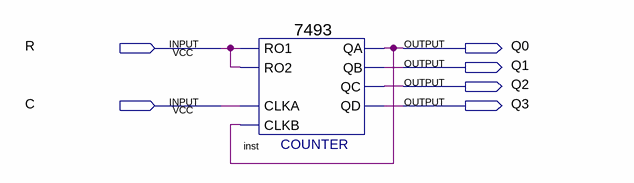
[diagram p0: schematic sheet]
// Quartus schematic point5.bdf as structural Verilog: 1 symbols, 6 pins
module point5 (
  input  R,
  input  C,
  output Q0,
  output Q1,
  output Q2,
  output Q3
);

  \7493  inst (.RO1(R), .RO2(R), .CLKA(C), .CLKB(Q0), .QC(Q2), .QB(Q1), .QA(Q0), .QD(Q3));
endmodule
